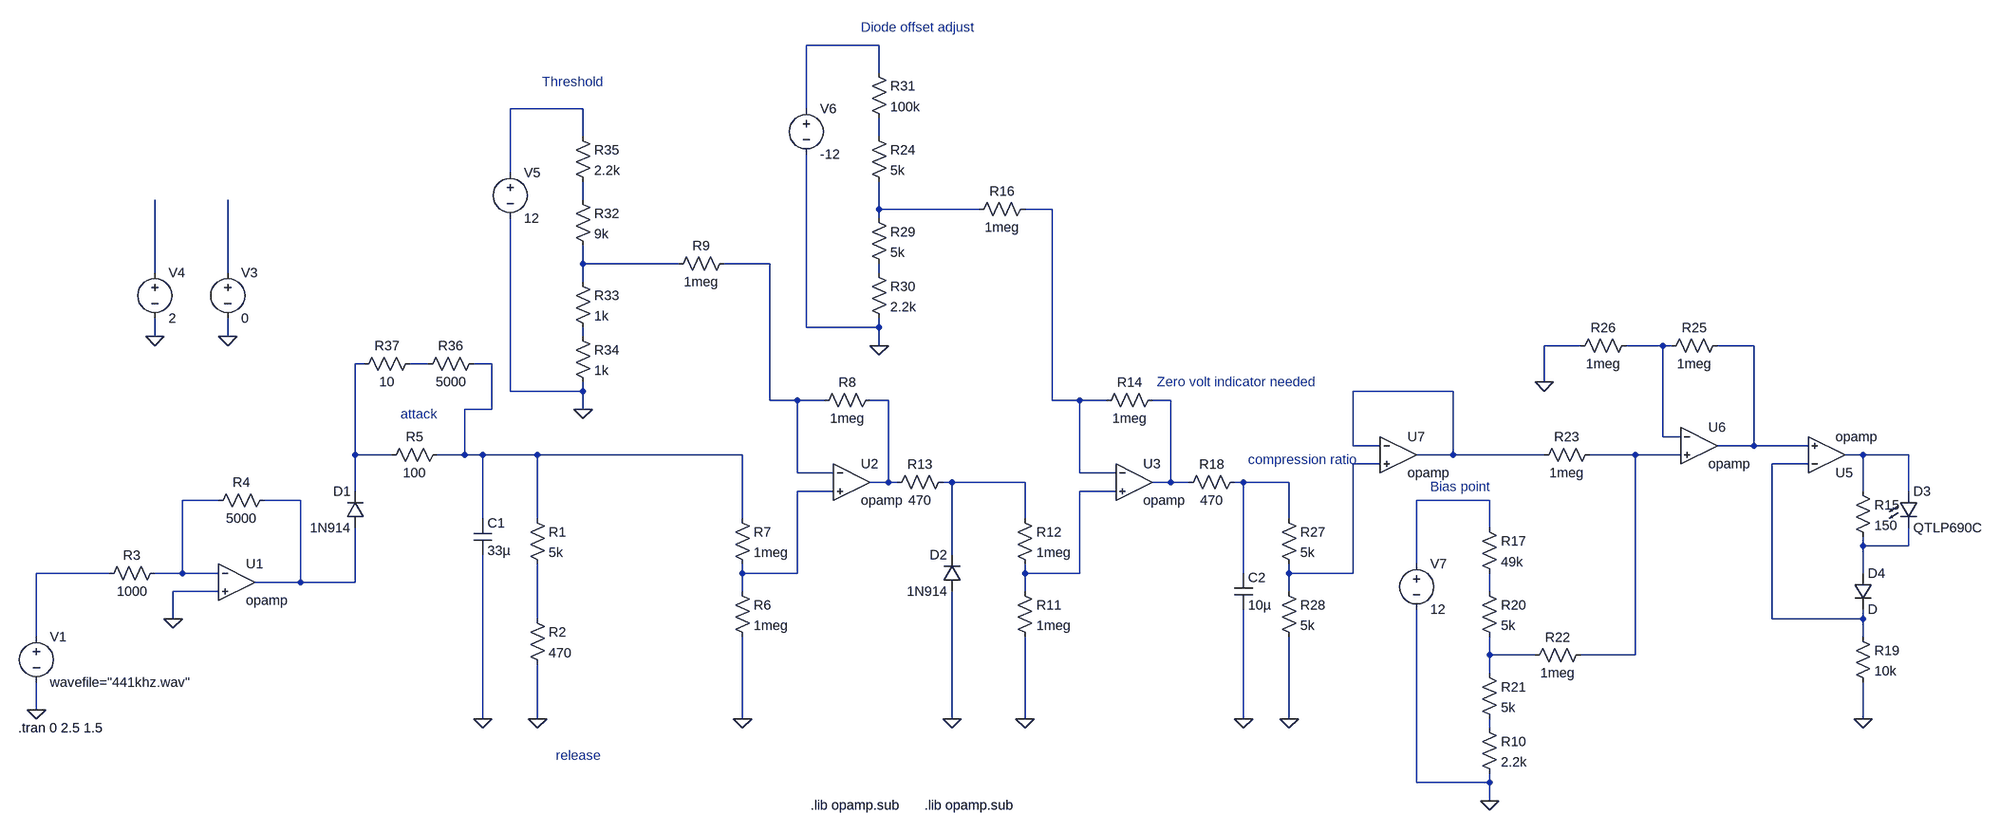
[diagram p0: schematic test_wavsource.asc]
test_wavsource.asc, the LTspice schematic file:
Version 4
SHEET 1 4852 868
WIRE 2288 -720 2160 -720
WIRE 2288 -672 2288 -720
WIRE 1728 -608 1600 -608
WIRE 2160 -608 2160 -720
WIRE 1728 -560 1728 -608
WIRE 2288 -560 2288 -592
WIRE 1600 -496 1600 -608
WIRE 1728 -448 1728 -480
WIRE 2288 -432 2288 -480
WIRE 2464 -432 2288 -432
WIRE 2592 -432 2544 -432
WIRE 2288 -416 2288 -432
WIRE 1728 -336 1728 -368
WIRE 1936 -336 1728 -336
WIRE 2096 -336 2016 -336
WIRE 976 -320 976 -448
WIRE 1104 -320 1104 -448
WIRE 2288 -320 2288 -336
WIRE 1728 -304 1728 -336
WIRE 2160 -224 2160 -528
WIRE 2288 -224 2288 -240
WIRE 2288 -224 2160 -224
WIRE 976 -208 976 -240
WIRE 1104 -208 1104 -240
WIRE 1728 -208 1728 -224
WIRE 2288 -192 2288 -224
WIRE 3520 -192 3456 -192
WIRE 3664 -192 3600 -192
WIRE 3680 -192 3664 -192
WIRE 3824 -192 3760 -192
WIRE 1344 -160 1328 -160
WIRE 1456 -160 1424 -160
WIRE 1568 -160 1536 -160
WIRE 3456 -128 3456 -192
WIRE 1600 -112 1600 -416
WIRE 1728 -112 1728 -128
WIRE 1728 -112 1600 -112
WIRE 3296 -112 3120 -112
WIRE 2096 -96 2096 -336
WIRE 2144 -96 2096 -96
WIRE 2192 -96 2144 -96
WIRE 2304 -96 2272 -96
WIRE 2592 -96 2592 -432
WIRE 2640 -96 2592 -96
WIRE 2688 -96 2640 -96
WIRE 2800 -96 2768 -96
WIRE 1568 -80 1568 -160
WIRE 1568 -80 1520 -80
WIRE 1728 -80 1728 -112
WIRE 3664 -32 3664 -192
WIRE 3696 -32 3664 -32
WIRE 3120 -16 3120 -112
WIRE 3168 -16 3120 -16
WIRE 3824 -16 3824 -192
WIRE 3824 -16 3760 -16
WIRE 3920 -16 3824 -16
WIRE 1328 0 1328 -160
WIRE 1392 0 1328 0
WIRE 1520 0 1520 -80
WIRE 1520 0 1472 0
WIRE 1552 0 1520 0
WIRE 1648 0 1552 0
WIRE 2048 0 1648 0
WIRE 3296 0 3296 -112
WIRE 3296 0 3232 0
WIRE 3456 0 3296 0
WIRE 3616 0 3536 0
WIRE 3696 0 3616 0
WIRE 4016 0 3984 0
WIRE 4096 0 4016 0
WIRE 3168 16 3120 16
WIRE 3920 16 3856 16
WIRE 2144 32 2144 -96
WIRE 2208 32 2144 32
WIRE 2640 32 2640 -96
WIRE 2704 32 2640 32
WIRE 2304 48 2304 -96
WIRE 2304 48 2272 48
WIRE 2320 48 2304 48
WIRE 2416 48 2400 48
WIRE 2544 48 2416 48
WIRE 2800 48 2800 -96
WIRE 2800 48 2768 48
WIRE 2832 48 2800 48
WIRE 2928 48 2912 48
WIRE 3008 48 2928 48
WIRE 1328 64 1328 0
WIRE 2208 64 2144 64
WIRE 2704 64 2640 64
WIRE 4016 64 4016 0
WIRE 4096 64 4096 0
WIRE 1088 80 1024 80
WIRE 1232 80 1168 80
WIRE 3360 80 3232 80
WIRE 1552 112 1552 0
WIRE 1648 112 1648 0
WIRE 2048 112 2048 0
WIRE 2544 112 2544 48
WIRE 3008 112 3008 48
WIRE 3360 128 3360 80
WIRE 4016 160 4016 144
WIRE 4096 160 4096 128
WIRE 4096 160 4016 160
WIRE 2416 176 2416 48
WIRE 3232 192 3232 80
WIRE 896 208 768 208
WIRE 1024 208 1024 80
WIRE 1024 208 976 208
WIRE 1088 208 1024 208
WIRE 2048 208 2048 192
WIRE 2144 208 2144 64
WIRE 2144 208 2048 208
WIRE 2544 208 2544 192
WIRE 2640 208 2640 64
WIRE 2640 208 2544 208
WIRE 2928 208 2928 48
WIRE 3008 208 3008 192
WIRE 3120 208 3120 16
WIRE 3120 208 3008 208
WIRE 4016 208 4016 160
WIRE 1232 224 1232 80
WIRE 1232 224 1152 224
WIRE 1328 224 1328 128
WIRE 1328 224 1232 224
WIRE 1088 240 1008 240
WIRE 2048 240 2048 208
WIRE 2544 240 2544 208
WIRE 3008 240 3008 208
WIRE 3360 240 3360 208
WIRE 1008 288 1008 240
WIRE 1648 288 1648 192
WIRE 3856 288 3856 16
WIRE 4016 288 4016 272
WIRE 4016 288 3856 288
WIRE 768 320 768 208
WIRE 4016 320 4016 288
WIRE 3360 352 3360 320
WIRE 3440 352 3360 352
WIRE 3616 352 3616 0
WIRE 3616 352 3520 352
WIRE 3360 384 3360 352
WIRE 768 448 768 400
WIRE 1552 464 1552 176
WIRE 1648 464 1648 368
WIRE 2048 464 2048 320
WIRE 2416 464 2416 240
WIRE 2544 464 2544 320
WIRE 2928 464 2928 272
WIRE 3008 464 3008 320
WIRE 4016 464 4016 400
WIRE 3360 480 3360 464
WIRE 3232 576 3232 272
WIRE 3360 576 3360 560
WIRE 3360 576 3232 576
WIRE 3360 608 3360 576
FLAG 768 448 0
FLAG 1008 288 0
FLAG 1648 464 0
FLAG 2048 464 0
FLAG 1552 464 0
FLAG 1104 -208 0
FLAG 2416 464 0
FLAG 976 -208 0
FLAG 4016 464 0
FLAG 3360 608 0
FLAG 3456 -128 0
FLAG 3008 464 0
FLAG 2544 464 0
FLAG 2928 464 0
FLAG 2288 -192 0
FLAG 1728 -80 0
SYMBOL voltage 768 304 R0
SYMATTR InstName V1
SYMATTR Value wavefile="441khz.wav"
SYMBOL diode 1344 128 R180
WINDOW 0 24 64 Left 2
WINDOW 3 24 0 Left 2
SYMATTR InstName D1
SYMATTR Value 1N914
SYMBOL cap 1536 112 R0
SYMATTR InstName C1
SYMATTR Value 33µ
SYMBOL res 1632 96 R0
SYMATTR InstName R1
SYMATTR Value 5k
SYMBOL Opamps\\opamp 1120 160 R0
SYMATTR InstName U1
SYMBOL res 1184 64 R90
WINDOW 0 0 56 VBottom 2
WINDOW 3 32 56 VTop 2
SYMATTR InstName R4
SYMATTR Value 5000
SYMBOL res 992 192 R90
WINDOW 0 0 56 VBottom 2
WINDOW 3 32 56 VTop 2
SYMATTR InstName R3
SYMATTR Value 1000
SYMBOL res 1632 272 R0
SYMATTR InstName R2
SYMATTR Value 470
SYMBOL res 1376 16 R270
WINDOW 0 32 56 VTop 2
WINDOW 3 0 56 VBottom 2
SYMATTR InstName R5
SYMATTR Value 100
SYMBOL Opamps\\opamp 2240 -16 R0
SYMATTR InstName U2
SYMBOL res 2032 224 R0
SYMATTR InstName R6
SYMATTR Value 1meg
SYMBOL res 2032 96 R0
SYMATTR InstName R7
SYMATTR Value 1meg
SYMBOL res 2176 -80 R270
WINDOW 0 32 56 VTop 2
WINDOW 3 0 56 VBottom 2
SYMATTR InstName R8
SYMATTR Value 1meg
SYMBOL res 1920 -320 R270
WINDOW 0 32 56 VTop 2
WINDOW 3 0 56 VBottom 2
SYMATTR InstName R9
SYMATTR Value 1meg
SYMBOL voltage 1104 -336 R0
WINDOW 123 0 0 Left 2
WINDOW 39 0 0 Left 2
SYMATTR InstName V3
SYMATTR Value 0
SYMBOL diode 2432 240 R180
WINDOW 0 24 64 Left 2
WINDOW 3 24 0 Left 2
SYMATTR InstName D2
SYMATTR Value 1N914
SYMBOL voltage 976 -336 R0
WINDOW 123 0 0 Left 2
WINDOW 39 0 0 Left 2
SYMATTR InstName V4
SYMATTR Value 2
SYMBOL Opamps\\opamp 3952 64 M180
SYMATTR InstName U5
SYMBOL LED 4080 64 R0
SYMATTR InstName D3
SYMATTR Value QTLP690C
SYMATTR Description Diode
SYMATTR Type diode
SYMBOL diode 4000 208 R0
SYMATTR InstName D4
SYMBOL res 4000 48 R0
SYMATTR InstName R15
SYMATTR Value 150
SYMBOL res 4000 304 R0
SYMATTR InstName R19
SYMATTR Value 10k
SYMBOL Opamps\\opamp 3728 -80 R0
SYMATTR InstName U6
SYMBOL res 3344 224 R0
SYMATTR InstName R20
SYMATTR Value 5k
SYMBOL res 3344 368 R0
SYMATTR InstName R21
SYMATTR Value 5k
SYMBOL res 3536 336 R90
WINDOW 0 0 56 VBottom 2
WINDOW 3 32 56 VTop 2
SYMATTR InstName R22
SYMATTR Value 1meg
SYMBOL res 3552 -16 R90
WINDOW 0 0 56 VBottom 2
WINDOW 3 32 56 VTop 2
SYMATTR InstName R23
SYMATTR Value 1meg
SYMBOL voltage 3232 176 R0
WINDOW 123 0 0 Left 2
WINDOW 39 0 0 Left 2
SYMATTR InstName V7
SYMATTR Value 12
SYMBOL res 3776 -208 R90
WINDOW 0 0 56 VBottom 2
WINDOW 3 32 56 VTop 2
SYMATTR InstName R25
SYMATTR Value 1meg
SYMBOL res 3616 -208 R90
WINDOW 0 0 56 VBottom 2
WINDOW 3 32 56 VTop 2
SYMATTR InstName R26
SYMATTR Value 1meg
SYMBOL Opamps\\opamp 3200 -64 R0
SYMATTR InstName U7
SYMBOL res 2992 96 R0
SYMATTR InstName R27
SYMATTR Value 5k
SYMBOL res 2992 224 R0
SYMATTR InstName R28
SYMATTR Value 5k
SYMBOL Opamps\\opamp 2736 -16 R0
SYMATTR InstName U3
SYMBOL res 2528 224 R0
SYMATTR InstName R11
SYMATTR Value 1meg
SYMBOL res 2528 96 R0
SYMATTR InstName R12
SYMATTR Value 1meg
SYMBOL res 2672 -80 R270
WINDOW 0 32 56 VTop 2
WINDOW 3 0 56 VBottom 2
SYMATTR InstName R14
SYMATTR Value 1meg
SYMBOL res 2448 -416 R270
WINDOW 0 32 56 VTop 2
WINDOW 3 0 56 VBottom 2
SYMATTR InstName R16
SYMATTR Value 1meg
SYMBOL res 2304 64 R270
WINDOW 0 32 56 VTop 2
WINDOW 3 0 56 VBottom 2
SYMATTR InstName R13
SYMATTR Value 470
SYMBOL res 3344 464 R0
SYMATTR InstName R10
SYMATTR Value 2.2k
SYMBOL res 3344 112 R0
SYMATTR InstName R17
SYMATTR Value 49k
SYMBOL res 2816 64 R270
WINDOW 0 32 56 VTop 2
WINDOW 3 0 56 VBottom 2
SYMATTR InstName R18
SYMATTR Value 470
SYMBOL cap 2912 208 R0
SYMATTR InstName C2
SYMATTR Value 10µ
SYMBOL res 2272 -576 R0
SYMATTR InstName R24
SYMATTR Value 5k
SYMBOL res 2272 -432 R0
SYMATTR InstName R29
SYMATTR Value 5k
SYMBOL voltage 2160 -624 R0
WINDOW 123 0 0 Left 2
WINDOW 39 0 0 Left 2
SYMATTR InstName V6
SYMATTR Value -12
SYMBOL res 2272 -336 R0
SYMATTR InstName R30
SYMATTR Value 2.2k
SYMBOL res 2272 -688 R0
SYMATTR InstName R31
SYMATTR Value 100k
SYMBOL res 1712 -464 R0
SYMATTR InstName R32
SYMATTR Value 9k
SYMBOL res 1712 -320 R0
SYMATTR InstName R33
SYMATTR Value 1k
SYMBOL res 1712 -224 R0
SYMATTR InstName R34
SYMATTR Value 1k
SYMBOL res 1712 -576 R0
SYMATTR InstName R35
SYMATTR Value 2.2k
SYMBOL voltage 1600 -512 R0
WINDOW 123 0 0 Left 2
WINDOW 39 0 0 Left 2
SYMATTR InstName V5
SYMATTR Value 12
SYMBOL res 1552 -176 R90
WINDOW 0 0 56 VBottom 2
WINDOW 3 32 56 VTop 2
SYMATTR InstName R36
SYMATTR Value 5000
SYMBOL res 1440 -176 R90
WINDOW 0 0 56 VBottom 2
WINDOW 3 32 56 VTop 2
SYMATTR InstName R37
SYMATTR Value 10
TEXT 736 480 Left 2 !.tran 0 2.5 1.5
TEXT 2168 616 Left 2 !.lib opamp.sub
TEXT 2368 616 Left 2 !.lib opamp.sub
TEXT 1656 -656 Left 2 ;Threshold
TEXT 2936 8 Left 2 ;compression ratio
TEXT 3256 56 Left 2 ;Bias point
TEXT 1680 528 Left 2 ;release
TEXT 1408 -72 Left 2 ;attack
TEXT 2256 -752 Left 2 ;Diode offset adjust
TEXT 2776 -128 Left 2 ;Zero volt indicator needed

The netlist it stands for:
* test_wavsource.asc
V1 N033 0 wavefile="441khz.wav"
D1 N030 N015 1N914
C1 N017 0 33µ
R1 N017 N035 5k
XU1 N029 0 N030 opamp Aol=100K GBW=10Meg  ; pins invin noninvin out
R4 N030 N029 5000
R3 N029 N033 1000
R2 N035 0 470
R5 N015 N017 100
XU2 N008 N027 N019 opamp Aol=100K GBW=10Meg  ; pins invin noninvin out
R6 N027 0 1meg
R7 N017 N027 1meg
R8 N008 N019 1meg
R9 N007 N008 1meg
V3 N010 0 0
D2 0 N025 1N914
V4 N009 0 2
XU5 N024 N014 N022 opamp Aol=100K GBW=10Meg  ; pins invin noninvin out
D3 N022 N032 QTLP690C
D4 N032 N024 D
R15 N022 N032 150
R19 N024 0 10k
XU6 N013 N021 N014 opamp Aol=100K GBW=10Meg  ; pins invin noninvin out
R20 N034 N036 5k
R21 N036 N037 5k
R22 N021 N036 1meg
R23 N021 N018 1meg
V7 N031 0 12
R25 N014 N013 1meg
R26 N013 0 1meg
XU7 N018 N023 N018 opamp Aol=100K GBW=10Meg  ; pins invin noninvin out
R27 N026 N023 5k
R28 N023 0 5k
XU3 N006 N028 N020 opamp Aol=100K GBW=10Meg  ; pins invin noninvin out
R11 N028 0 1meg
R12 N025 N028 1meg
R14 N006 N020 1meg
R16 N005 N006 1meg
R13 N019 N025 470
R10 N037 0 2.2k
R17 N031 N034 49k
R18 N020 N026 470
C2 N026 0 10µ
R24 N003 N005 5k
R29 N005 N011 5k
V6 N001 0 -12
R30 N011 0 2.2k
R31 N001 N003 100k
R32 N004 N007 9k
R33 N007 N012 1k
R34 N012 0 1k
R35 N002 N004 2.2k
V5 N002 0 12
R36 N017 N016 5000
R37 N016 N015 10
.model D D
.lib standard.dio
.tran 0 2.5 1.5
.lib opamp.sub
.lib opamp.sub
* Threshold
* compression ratio
* Bias point
* release
* attack
* Diode offset adjust
* Zero volt indicator needed
.backanno
.end